# EAGLE design schema_v3_1_SMD_DIP (EAGLE 6.2)
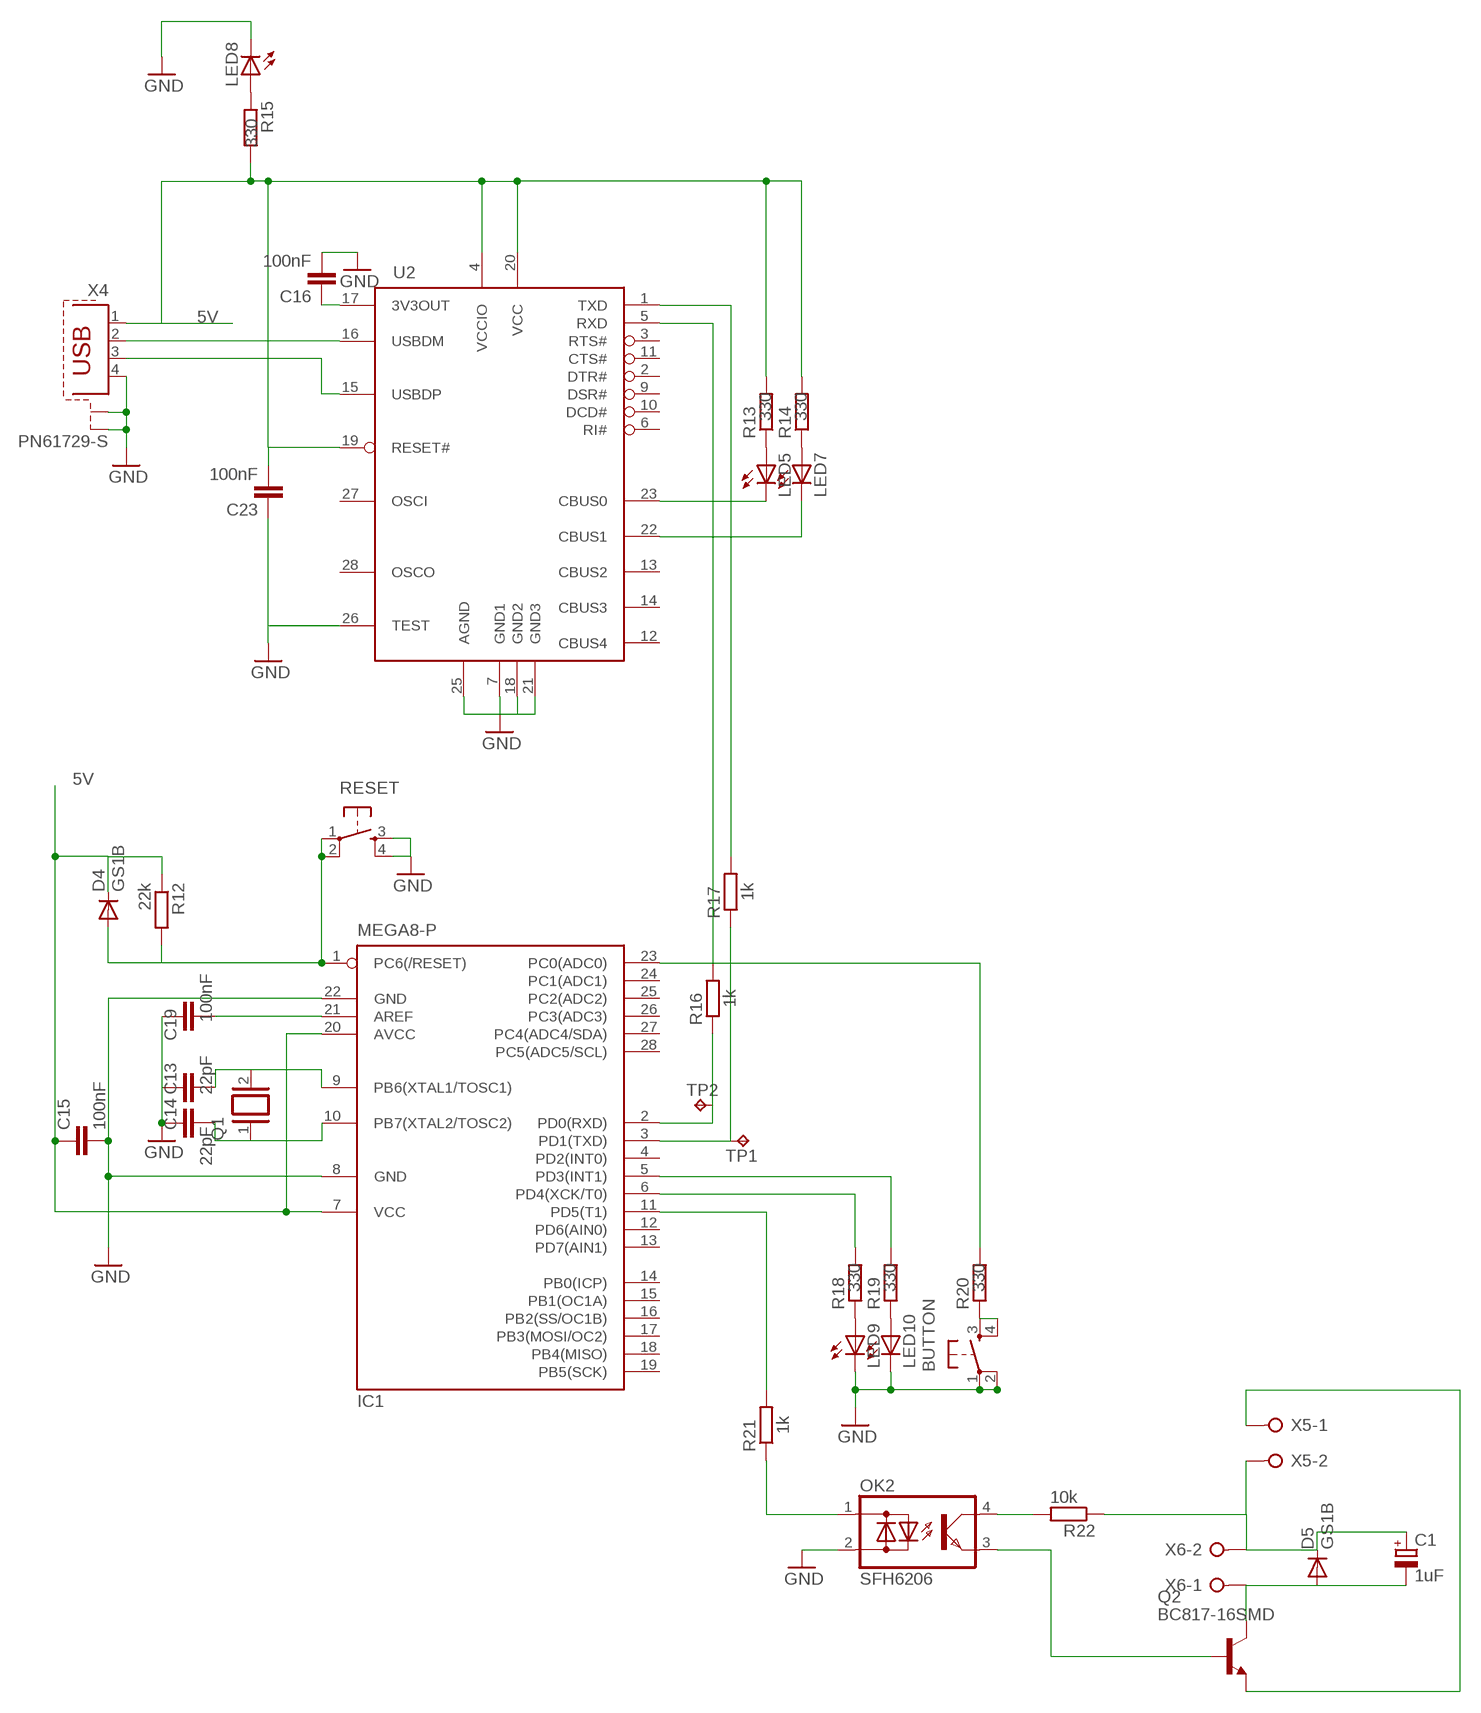
[diagram p0: schematic, sheet 1]

## Parts
BUTTON  TAC_SWITCHSMD  [TACTILE_SWITCH_SMD]
C1  1uF  CPOL-EUE2.5-5  [E2,5-5]
C13  22pF  C-EUC0805  [C0805]
C14  22pF  C-EUC0805  [C0805]
C15  100nF  C-EUC0805  [C0805]
C16  100nF  C-EUC0805  [C0805]
C19  100nF  C-EUC0805  [C0805]
C23  100nF  C-EUC0805  [C0805]
D4  GS1B  DIODE-DO214AC  [DO214AC]
D5  GS1B  DIODE-DO214AC  [DO214AC]
IC1  MEGA8-P  [DIL28-3]
LED5  LEDSMT1206  [1206]
LED7  LEDSMT1206  [1206]
LED8  LEDSMT1206  [1206]
LED9  LEDSMT1206  [1206]
LED10  LEDSMT1206  [1206]
OK2  SFH6206  [DIL4-SMD]
Q1  XTAL  [Q]
Q2  BC817-16SMD  [SOT23-BEC]
R12  22k  R-EU_R0805  [R0805]
R13  330  R-EU_R0805  [R0805]
R14  330  R-EU_R0805  [R0805]
R15  330  R-EU_R0805  [R0805]
R16  1k  R-EU_R0805  [R0805]
R17  1k  R-EU_R0805  [R0805]
R18  330  R-EU_R0805  [R0805]
R19  330  R-EU_R0805  [R0805]
R20  330  R-EU_R0805  [R0805]
R21  1k  R-EU_R0805  [R0805]
R22  10k  R-EU_R0805  [R0805]
RESET  TAC_SWITCHSMD  [TACTILE_SWITCH_SMD]
TP1  TPTP13R  [TP13R]
TP2  TPTP13R  [TP13R]
U2  FT232RL  [SSOP28DB]
X4  PN61729-S  [PN61729-S]
X5  W237-02P  [W237-132]
X6  W237-02P  [W237-132]

## Nets
5V: C15.1 C23.2 D4.C IC1.7(VCC) IC1.20(AVCC) R12.1 R13.2 R14.2 R15.2 U2.4(VCCIO) U2.19(RESET#) U2.20(VCC) X4.1
GND: BUTTON.1 BUTTON.2 C13.1 C14.1 C15.2 C16.2 C19.2 C23.1 IC1.8(GND) IC1.22(GND) LED8.C LED9.C LED10.C OK2.2(AC2) RESET.3 RESET.4 U2.26(TEST) X4.4 X4.S1 X4.S2
N$1: IC1.2(PD0(RXD)) R16.1 TP2.TP
N$2: IC1.3(PD1(TXD)) R17.1 TP1.TP
N$3: C19.1 IC1.21(AREF)
N$4: C14.2 IC1.10(PB7(XTAL2/TOSC2)) Q1.1
N$5: C13.2 IC1.9(PB6(XTAL1/TOSC1)) Q1.2
N$38: D4.A IC1.1(PC6(/RESET)) R12.2 RESET.1 RESET.2
N$39: LED5.A R13.1
N$40: LED7.A R14.1
N$41: LED5.C U2.23(CBUS0)
N$42: LED7.C U2.22(CBUS1)
N$43: R16.2 U2.5(RXD)
N$44: R17.2 U2.1(TXD)
N$45: BUTTON.3 BUTTON.4 R20.1
N$46: IC1.6(PD4(XCK/T0)) R18.2
N$48: U2.16(USBDM) X4.2
N$49: U2.15(USBDP) X4.3
N$50: IC1.5(PD3(INT1)) R19.2
N$51: LED8.A R15.1
N$52: IC1.23(PC0(ADC0)) R20.2
N$96: C16.1 U2.17(3V3OUT)
N$97: LED9.A R18.1
N$98: LED10.A R19.1
N$101: OK2.3(E) Q2.B
N$102: OK2.1(AC1) R21.1
N$103: IC1.11(PD5(T1)) R21.2
N$104: OK2.4(C) R22.2
N$105: C1.+ D5.C R22.1 X5.2 X6.2
N$106: C1.- D5.A Q2.C X6.1
N$107: Q2.E X5.1
Unconnected: IC1.4(PD2(INT0)) IC1.12(PD6(AIN0)) IC1.13(PD7(AIN1)) IC1.14(PB0(ICP)) IC1.15(PB1(OC1A)) IC1.16(PB2(SS/OC1B)) IC1.17(PB3(MOSI/OC2)) IC1.18(PB4(MISO)) IC1.19(PB5(SCK)) IC1.24(PC1(ADC1)) IC1.25(PC2(ADC2)) IC1.26(PC3(ADC3)) IC1.27(PC4(ADC4/SDA)) IC1.28(PC5(ADC5/SCL)) U2.2(DTR#) U2.3(RTS#) U2.6(RI#) U2.9(DSR#) U2.10(DCD#) U2.11(CTS#) U2.12(CBUS4) U2.13(CBUS2) U2.14(CBUS3) U2.27(OSCI) U2.28(OSCO)

## Power pins joined to a net without a drawn wire
AGND: U2.25(AGND)
GND1: U2.7(GND1)
GND2: U2.18(GND2)
GND3: U2.21(GND3)

## Library data of the parts
BUTTON RESET = SparkFun:TAC_SWITCH: Momentary Switch Button commonly used for reset or general input. Spark Fun Electronics SKU : COM-00097
C1 = rcl:CPOL-EU: POLARIZED CAPACITOR, European symbol
C13-C16 C19 C23 = rcl:C-EU: CAPACITOR, European symbol
D4 D5 = diode:DIODE-: DIODE
IC1 = atmel:MEGA8-P: MICROCONTROLLER 8 Kbytes FLASH, 1 kbytes SRAM, 512 bytes EEPROM, USART, 4-channel 10 bit ADC, 2-channel 8 bit ADC Pin compatible with Atmega48, ATMega88, ATMega168 Source: avr.lbr; OC_FARNELL: unknown; OC_NEWARK: unknown
LED5 LED7-LED10 = led:LED: LED OSRAM: - CHIPLED LG R971, LG N971, LY N971, LG Q971, LY Q971, LO R971, LY R971 LH N974, LH R974 LS Q976, LO Q976, LY Q976 LO Q996 - Hyper CHIPLED LW Q18S LB Q993, LB Q99A, LB R99A - SideLED LS A670, LO A670, LY A670, LG A670, LP A670 LB A673, LV A673, LT A673, LW A673 LH A674 LY A675 LS A676, LA A676, LO A676, LY A676, LW A676 LS A679, LY A679, LG A679 - Hyper Micro SIDELED® LS Y876, LA Y876, LO Y876, LY Y876 LT Y87S - SmartLED LW L88C, LW L88S LB L89C, LB L89S, LG L890 LS L89K, LO L89K, LY L89K LS L896, LA L896, LO L896, LY L896 - TOPLED LS T670, LO T670, LY T670, LG T670, LP T670 LSG T670, LSP T670, LSY T670, LOP T670, LYG T670 LG T671, LOG T671, LSG T671 LB T673, LV T673, LT T673, LW T673 LH T674 LS T676, LA T676, LO T676, LY T676, LB T676, LH T676, LSB T676, LW T676 LB T67C, LV T67C, LT T67C, LS T67K, LO T67K, LY T67K, LW E67C LS E67B, LA E67B, LO E67B, LY E67B, LB E67C, LV E67C, LT E67C LW T67C LS T679, LY T679, LG T679 LS T770, LO T770, LY T770, LG T770, LP T770 LB T773, LV T773, LT T773, LW T773 LH T774 LS E675, LA E675, LY E675, LS T675 LS T776, LA T776, LO T776, LY T776, LB T776 LHGB T686 LT T68C, LB T68C - Hyper Mini TOPLED® LB M676 - Mini TOPLED Santana® LG M470 LS M47K, LO M47K, LY M47K Source: http://www.osram.convergy.de LUXEON: - LUMILED® LXK2-PW12-R00, LXK2-PW12-S00, LXK2-PW14-U00, LXK2-PW14-V00 LXK2-PM12-R00, LXK2-PM12-S00, LXK2-PM14-U00 LXK2-PE12-Q00, LXK2-PE12-R00, LXK2-PE12-S00, LXK2-PE14-T00, LXK2-PE14-U00 LXK2-PB12-K00, LXK2-PB12-L00, LXK2-PB12-M00, LXK2-PB14-N00, LXK2-PB14-P00, LXK2-PB14-Q00 LXK2-PR12-L00, LXK2-PR12-M00, LXK2-PR14-Q00, LXK2-PR14-R00 LXK2-PD12-Q00, LXK2-PD12-R00, LXK2-PD12-S00 LXK2-PH12-R00, LXK2-PH12-S00 LXK2-PL12-P00, LXK2-PL12-Q00, LXK2-PL12-R00 Source: www.luxeon.com KINGBRIGHT: KA-3528ASYC Source: www.kingbright.com
OK2 = optocoupler:SFH620: Optocoupler, Phototransistor Output, AC Input Source: http://www.vishay.com/docs/83675/sfh620.pdf; MF: VISHAY/TELEFUNKEN; MPN: SFH6206-3; OC_FARNELL: 1469585; OC_NEWARK: 58K2214
Q1 = special:XTAL: CRYSTAL
Q2 = transistor-npn:BC817*: NPN Transistor
R12-R22 = rcl:R-EU_: RESISTOR, European symbol
TP1 TP2 = testpad:TP: Test pad
U2 = ftdichip-5:FT232RL: USB UART 4th Generation USB UART (USB <-> Serial) Controller
X4 = con-berg:PN61729-S: BERG USB connector; OC_FARNELL: unknown; OC_NEWARK: unknown
X5 X6 = con-wago-508:W237-02P: WAGO SREW CLAMP; OC_FARNELL: unknown; OC_NEWARK: unknown

## Net classes
0 default: width 0.203 mm

## Board
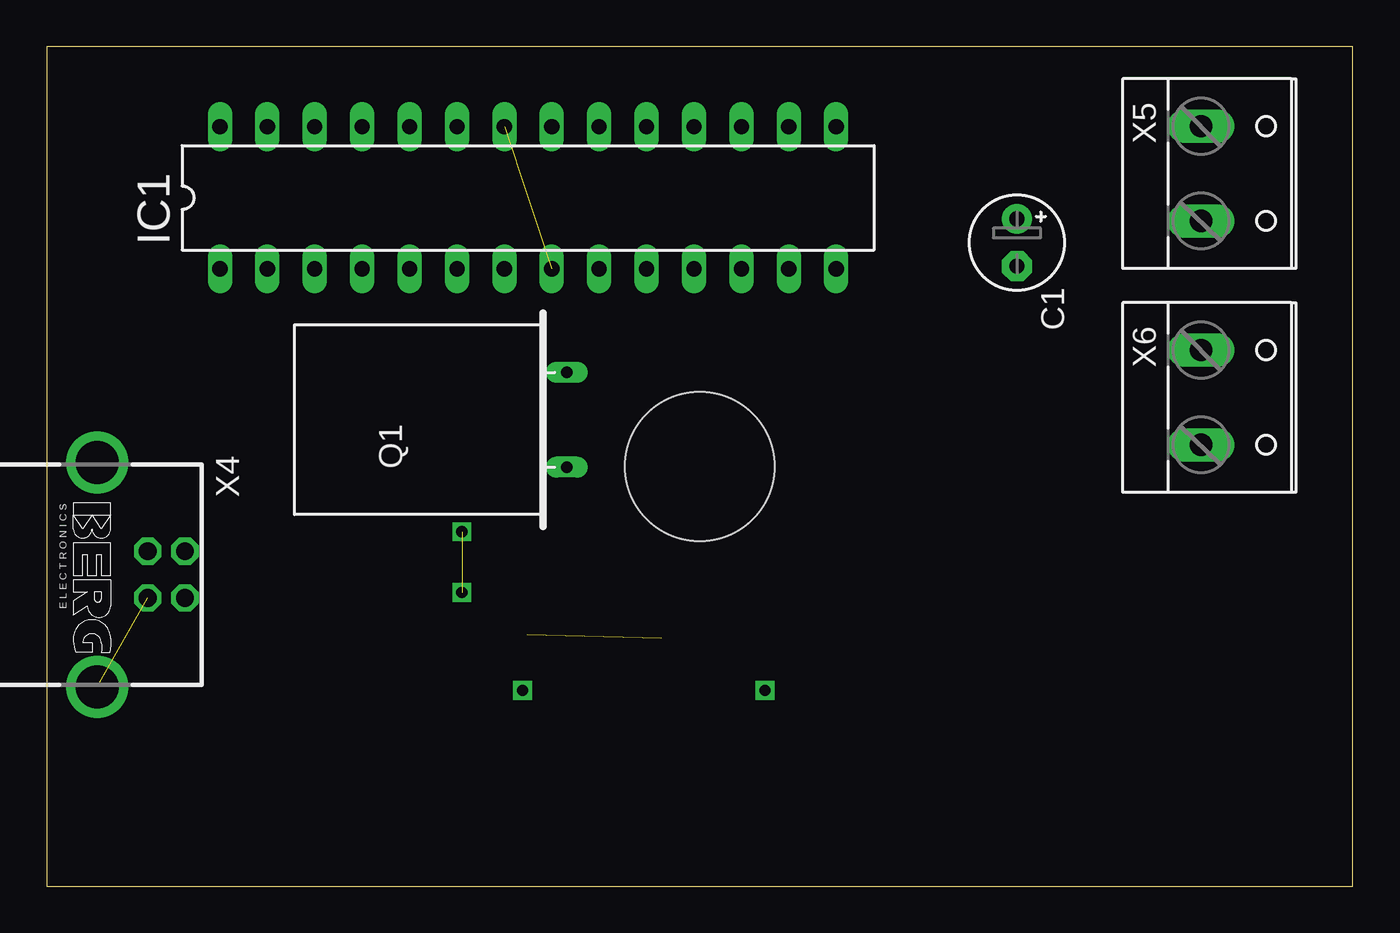
[diagram p1: board, top side]
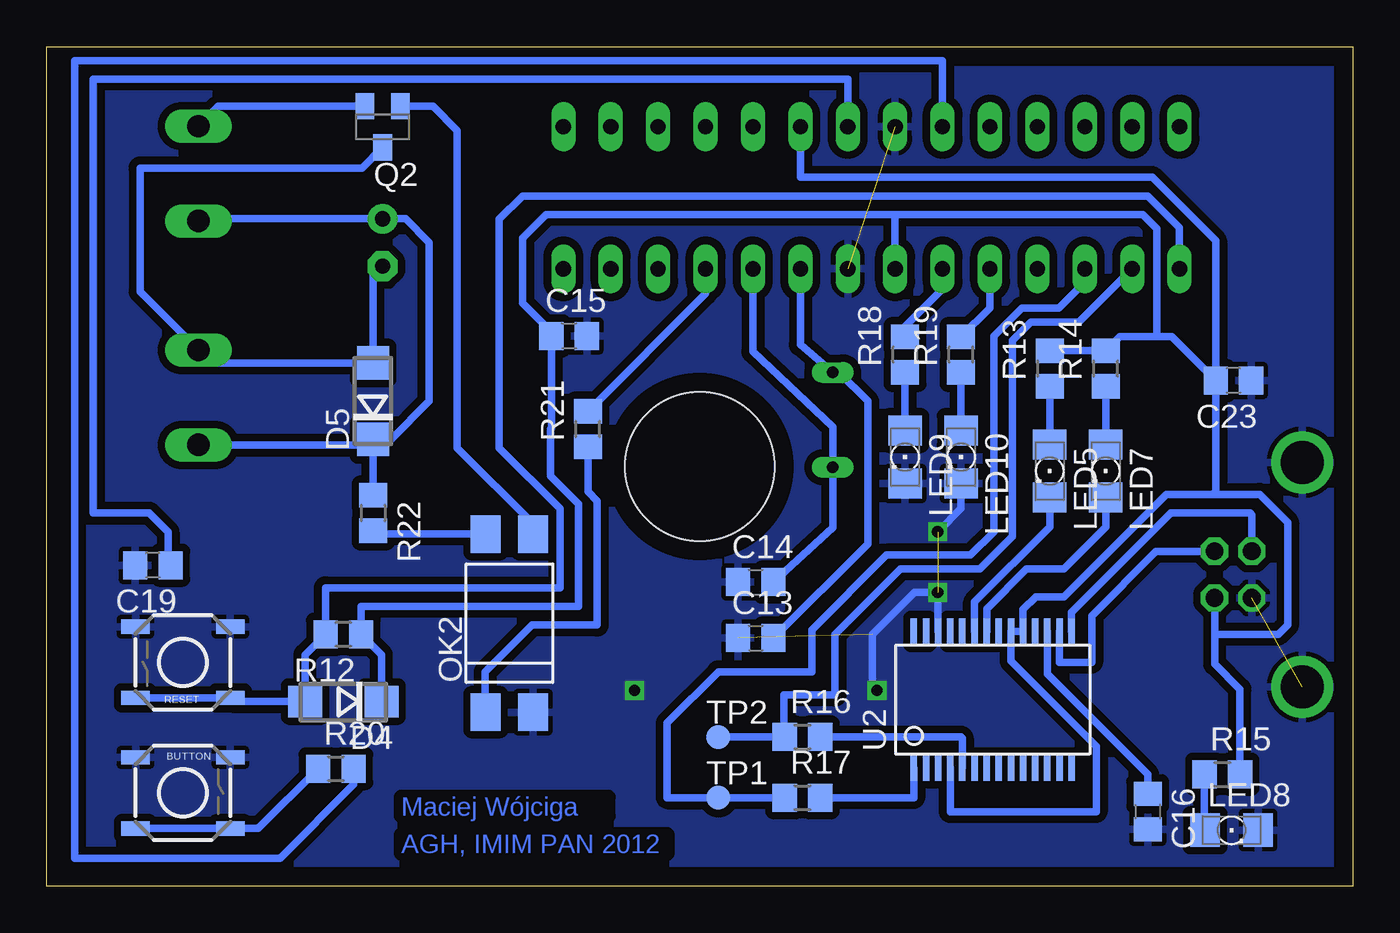
[diagram p2: board, bottom side, seen from below]

Size 70 x 45 mm. Coordinates in mm from the lower left corner, seen from the top.
Outline: 0,0 70,0 70,45 0,45 0,0
Copper layers (1*16): Top 0.035mm / dielectric 1.5mm / Bottom 0.035mm
Design rules: minimum track width 10mil, minimum drill 24mil, track to track 8mil, track to pad 8mil, pad to pad 8mil, via to via 8mil, smd to smd 8mil, copper to edge 40mil, drill to drill 8mil, minimum pad ring 10mil, minimum via ring 8mil, stop-mask expansion 4mil, vias tented up to drill 0mil, thermal gap 10mil
Holes 8 mm at 35,22.5

### Footprints (pad centres in the part's own frame; a part is rotated, then mirrored left to right if it is on the bottom)
TACTILE_SWITCH_SMD = smd 1.524 x 0.762: 1 -2.54,1.905; 2 2.54,1.905; 3 -2.54,-1.905; 4 2.54,-1.905
E2,5-5 = drill 0.813 pad 1.6: + -1.27,0 | drill 0.813 pad 1.6 octagon: - 1.27,0
C0805 = smd 1.3 x 1.5: 1 -0.95,0; 2 0.95,0
DO214AC = smd 1.8 x 1.7: A 2.05,0; C -2.05,0
DIL28-3 = drill 0.813 long: 1 -16.51,-3.81; 2 -13.97,-3.81; 3 -11.43,-3.81; 4 -8.89,-3.81; 5 -6.35,-3.81; 6 -3.81,-3.81; 7 -1.27,-3.81; 8 1.27,-3.81; 9 3.81,-3.81; 10 6.35,-3.81; 11 8.89,-3.81; 12 11.43,-3.81; 13 13.97,-3.81; 14 16.51,-3.81; 15 16.51,3.81; 16 13.97,3.81; 17 11.43,3.81; 18 8.89,3.81; 19 6.35,3.81; 20 3.81,3.81; 21 1.27,3.81; 22 -1.27,3.81; 23 -3.81,3.81; 24 -6.35,3.81; 25 -8.89,3.81; 26 -11.43,3.81; 27 -13.97,3.81; 28 -16.51,3.81
1206 = smd 1.6 x 1.803: A -1.422,0; C 1.422,0
DIL4-SMD = smd 1.6 x 2: 1 -1.27,-4.77; 2 1.27,-4.77; 3 1.27,4.77; 4 -1.27,4.77
Q = drill 0.61 long: 1 -2.54,-7.62; 2 2.54,-7.62
SOT23-BEC = smd 1 x 1.4: B -0.95,-1.1; C 0,1.1; E 0.95,-1.1
R0805 = smd 1.3 x 1.5: 1 -0.95,0; 2 0.95,0
TP13R = smd 1.3 x 1.3: TP 0,0
SSOP28DB = smd 0.348 x 1.397: 1 -4.225,-3.656; 2 -3.575,-3.656; 3 -2.925,-3.656; 4 -2.275,-3.656; 5 -1.625,-3.656; 6 -0.975,-3.656; 7 -0.325,-3.656; 8 0.325,-3.656; 9 0.975,-3.656; 10 1.625,-3.656; 11 2.275,-3.656; 12 2.925,-3.656; 13 3.575,-3.656; 14 4.225,-3.656; 15 4.225,3.656; 16 3.575,3.656; 17 2.925,3.656; 18 2.275,3.656; 19 1.625,3.656; 20 0.975,3.656; 21 0.325,3.656; 22 -0.325,3.656; 23 -0.975,3.656; 24 -1.625,3.656; 25 -2.275,3.656; 26 -2.925,3.656; 27 -3.575,3.656; 28 -4.225,3.656
PN61729-S = drill 0.95 octagon: 1 1.25,4.71; 2 -1.25,4.71; 3 -1.25,2.71; 4 1.25,2.71 | drill 2.3 pad 2.9: S1 -6.02,0; S2 6.02,0
W237-132 = drill 1.194 long: 1 -2.54,-0.635; 2 2.54,-0.635

### Placement (x,y rotation side)
BUTTON  62.7,5 0 bottom
C1  52,34.5 270 top
C13  32,13.3 0 bottom
C14  32,16.3 0 bottom
C15  42,29.5 0 bottom
C16  11,4 270 bottom
C19  64.3,17.2 180 bottom
C23  6.4,27.1 180 bottom
D4  54.1,9.9 180 bottom
D5  52.5,26 90 bottom
IC1  25.8,36.9 0 top
LED5  16.25,22.25 270 bottom
LED7  13.25,22.25 270 bottom
LED8  6.5,3 0 bottom
LED9  24,23 270 bottom
LED10  21,23 270 bottom
OK2  45.2,14.1 0 bottom
Q1  20.25,25 90 top
Q2  52,40.7 180 bottom
R12  54.1,13.5 180 bottom
R13  16.25,27.75 90 bottom
R14  13.25,27.75 90 bottom
R15  7,6 0 bottom
R16  29.5,8 0 bottom
R17  29.5,4.75 0 bottom
R18  24,28.5 90 bottom
R19  21,28.5 90 bottom
R20  54.5,6.3 0 bottom
R21  41,24.5 90 bottom
R22  52.5,20 270 bottom
RESET  62.7,12 180 bottom
TP1  34,4.75 0 bottom
TP2  34,8 0 bottom
U2  19.3,10 0 bottom
X4  2.7,16.7 270 top
X5  62.5,38.2 270 top
X6  62.5,26.2 270 top

### Tracks (layer width: path | path; a pad name or v marks a point on that pad's centre or on a via)
5V
  Bottom 0.406: R15.2 6.05,10.55 7.41,11.91 7.41,13.5 | 7.41,13.5 X4.1 | 7.5,21 10,21 15.5,15.5 17,15.5 17.68,14.82 U2.19 U2.20 18.32,12.07 13.75,7.5 13.75,4 21.57,4 U2.4 | 7.5,21 5,21 3.5,19.5 3.5,14 4,13.5 7.41,13.5 | C23.2 7.35,21.15 7.5,21 | D4.C 52.05,12.4 R12.1 53.15,15 41.5,15 41.5,20.5 43,22 43,24.5 42.95,24.55 C15.1 42.95,29.7 44.5,31.25 44.5,34.75 43.25,36 24.53,36 | C23.2 9.7,29.45 10.5,29.45 | 16.25,28.75 R13.2 R14.2 12.5,29.45 10.5,29.45 | IC1.7 24.53,36 | 24.53,36 11.25,36 10.5,35.25 10.5,29.45 | IC1.20 29.61,38 10.75,38 7.35,34.6 C23.2
GND  (via drill 0.6)  (4 unrouted)
  Bottom 0.406: U2.26 22.25,13.68 v22.25,15.75 23.5,15.75 25.75,13.5 25.75,10.75 v25.5,10.5 | v22.25,19 21,20.25 LED10.C
  other vias: 38.5,10.5
  pour Bottom (isolate 0.406): 0,45 70,45 70,0 0,0
N$1
  Bottom 0.406: TP2.TP R16.1 30.5,8 30.5,10.25 27.75,10.25 27.75,13.5 24.25,17 20,17 18.25,18.75 18.25,29.25 17.25,30.25 14.67,30.25 IC1.2
N$2
  Bottom 0.406: R17.1 TP1.TP 36.75,4.75 36.75,8.75 34,11.5 29,11.5 29,13.75 25,17.75 20.5,17.75 19.25,19 19.25,29.5 17.75,31 15.75,31 14.37,32.38 IC1.3
N$3
  Bottom 0.406: C19.1 63.5,17.35 63.5,19 64.5,20 67.5,20 67.5,43.25 27.07,43.25 IC1.21
N$4
  Bottom 0.406: C14.2 27.87,19.23 Q1.1 27.87,24.62 32.15,28.65 IC1.10
N$5
  Bottom 0.406: C13.2 26,18.35 26,26 27.54,27.54 Q1.2 29.61,29.03 IC1.9
N$38
  Bottom 0.406: RESET.2 RESET.1 59.97,9.9 D4.A 56.15,12.4 R12.2 55.05,16 42.5,16 42.5,20.25 45.75,23.5 45.75,35.75 44.5,37 11,37 9.29,35.29 IC1.1
N$39
  Bottom 0.406: R13.1 LED5.A
N$40
  Bottom 0.406: R14.1 LED7.A
N$41
  Bottom 0.406: U2.23 20.27,15.22 16.25,19.25 LED5.C
N$42
  Bottom 0.406: U2.22 19.62,14.88 17.5,17 15.5,17 13.25,19.25 LED7.C
N$43
  Bottom 0.406: R16.2 21,8 20.93,7.92 U2.5
N$44
  Bottom 0.406: U2.1 23.52,4.75 R17.2
N$45
  Bottom 0.406: R20.1 58.66,3.1 BUTTON.4 BUTTON.3
N$46
  Bottom 0.406: R18.2 24,30 22,32 IC1.6
N$48
  Bottom 0.406: X4.2 10.55,17.95 14,14.5 14,12 15.72,12 U2.16
N$49
  Bottom 0.406: X4.3 5.41,19.91 5.5,20 9.75,20 15.07,14.68 U2.15
N$50
  Bottom 0.406: IC1.5 19.45,31 R19.2
N$51
  Bottom 0.406: R15.1 7.95,3.03 LED8.A
N$52
  Bottom 0.406: IC1.23 21.99,44.25 68.5,44.25 68.5,1.5 57.5,1.5 53.55,5.45 R20.2
N$96
  Bottom 0.406: U2.17 16.38,11.38 11,6 C16.1
N$97
  Bottom 0.406: R18.1 LED9.A
N$98
  Bottom 0.406: R19.1 LED10.A
N$101
  Bottom 0.406: OK2.3 43.93,19.43 48,23.5 48,40.5 49.3,41.8 Q2.B
N$102
  Bottom 0.406: OK2.1 46.5,9.36 46.5,11.5 44,14 40.5,14 40.5,20.65 41,21.15 R21.1
N$103
  Bottom 0.406: IC1.11 34.69,31.76 R21.2
N$104
  Bottom 0.406: OK2.4 52.32,18.87 R22.2
N$105
  Bottom 0.406: R22.1 D5.C | X6.2 52.79,23.66 D5.C | D5.C 51.55,23.95 49.5,26 49.5,34.5 50.77,35.77 C1.+ 61.76,35.77 arc-90 X5.2
N$106
  Bottom 0.406: C1.- 52.5,32.73 D5.A 61.17,28.05 X6.1 65,31.88 65,38.5 53.1,38.5 Q2.C
N$107
  Bottom 0.406: Q2.E 60.8,41.8 X5.1

### Text on the board
Bottom: Maciej Wójciga | AGH, IMIM PAN 2012